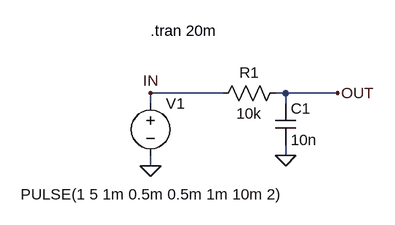
[diagram p0: schematic LPF_TD.asc]
LPF_TD.asc, the LTspice schematic file:
Version 4
SHEET 1 896 680
WIRE -16 96 -128 96
WIRE 80 96 64 96
WIRE 160 96 80 96
WIRE -128 112 -128 96
WIRE 80 112 80 96
WIRE 80 192 80 176
WIRE -128 208 -128 192
FLAG -128 208 0
FLAG -128 96 IN
FLAG 160 96 OUT
FLAG 80 192 0
SYMBOL voltage -128 96 R0
WINDOW 123 0 0 Left 2
WINDOW 39 0 0 Left 2
WINDOW 3 -200 156 Left 2
SYMATTR Value PULSE(1 5 1m 0.5m 0.5m 1m 10m 2)
SYMATTR InstName V1
SYMBOL cap 64 112 R0
SYMATTR InstName C1
SYMATTR Value 10n
SYMBOL res 80 80 R90
WINDOW 0 0 56 VBottom 2
WINDOW 3 32 56 VTop 2
SYMATTR InstName R1
SYMATTR Value 10k
TEXT -128 0 Left 2 !.tran 20m

The netlist it stands for:
* LPF_TD.asc
V1 IN 0 PULSE(1 5 1m 0.5m 0.5m 1m 10m 2)
C1 OUT 0 10n
R1 OUT IN 10k
.tran 20m
.backanno
.end